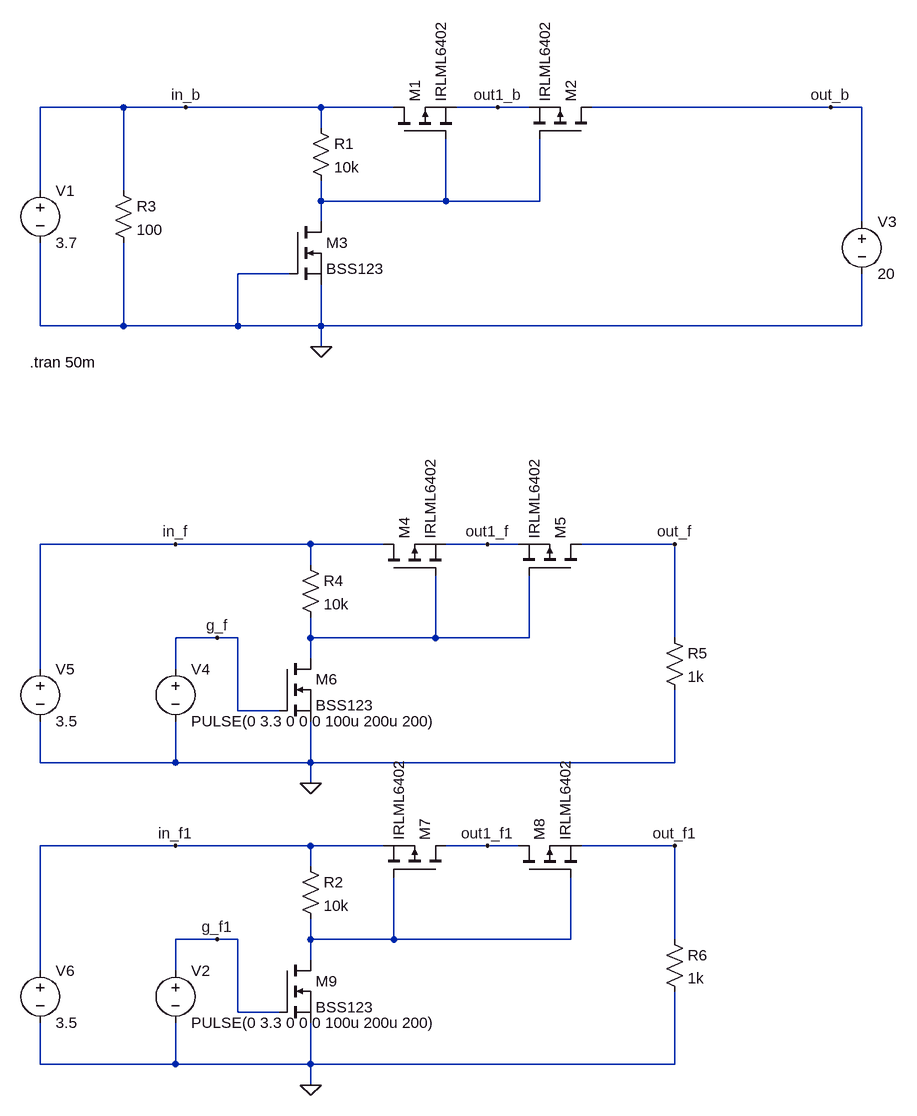
[diagram p0: schematic backDriveProtection.asc]
backDriveProtection.asc, the LTspice schematic file:
Version 4
SHEET 1 880 1620
WIRE -448 96 -576 96
WIRE -352 96 -448 96
WIRE -144 96 -352 96
WIRE -32 96 -144 96
WIRE 128 96 64 96
WIRE 176 96 128 96
WIRE 640 96 272 96
WIRE 688 96 640 96
WIRE -144 128 -144 96
WIRE -576 224 -576 96
WIRE -448 224 -448 96
WIRE -144 240 -144 208
WIRE 48 240 48 144
WIRE 48 240 -144 240
WIRE 192 240 192 144
WIRE 192 240 48 240
WIRE -144 272 -144 240
WIRE 688 272 688 96
WIRE -192 352 -272 352
WIRE -576 432 -576 304
WIRE -448 432 -448 304
WIRE -448 432 -576 432
WIRE -272 432 -272 352
WIRE -272 432 -448 432
WIRE -144 432 -144 368
WIRE -144 432 -272 432
WIRE 688 432 688 352
WIRE 688 432 -144 432
WIRE -144 464 -144 432
WIRE -368 768 -576 768
WIRE -160 768 -368 768
WIRE -48 768 -160 768
WIRE 112 768 48 768
WIRE 160 768 112 768
WIRE 400 768 256 768
WIRE -160 800 -160 768
WIRE -304 912 -368 912
WIRE -272 912 -304 912
WIRE -160 912 -160 880
WIRE 32 912 32 816
WIRE 32 912 -160 912
WIRE 176 912 176 816
WIRE 176 912 32 912
WIRE 400 912 400 768
WIRE -160 944 -160 912
WIRE -576 960 -576 768
WIRE -368 960 -368 912
WIRE -272 1024 -272 912
WIRE -208 1024 -272 1024
WIRE -576 1104 -576 1040
WIRE -368 1104 -368 1040
WIRE -368 1104 -576 1104
WIRE -160 1104 -160 1040
WIRE -160 1104 -368 1104
WIRE 400 1104 400 992
WIRE 400 1104 -160 1104
WIRE -160 1136 -160 1104
WIRE -368 1232 -576 1232
WIRE -160 1232 -368 1232
WIRE -48 1232 -160 1232
WIRE 112 1232 48 1232
WIRE 160 1232 112 1232
WIRE 400 1232 256 1232
WIRE -160 1264 -160 1232
WIRE -304 1376 -368 1376
WIRE -272 1376 -304 1376
WIRE -160 1376 -160 1344
WIRE -32 1376 -32 1280
WIRE -32 1376 -160 1376
WIRE 240 1376 240 1280
WIRE 240 1376 -32 1376
WIRE 400 1376 400 1232
WIRE -160 1408 -160 1376
WIRE -576 1424 -576 1232
WIRE -368 1424 -368 1376
WIRE -272 1488 -272 1376
WIRE -208 1488 -272 1488
WIRE -576 1568 -576 1504
WIRE -368 1568 -368 1504
WIRE -368 1568 -576 1568
WIRE -160 1568 -160 1504
WIRE -160 1568 -368 1568
WIRE 400 1568 400 1456
WIRE 400 1568 -160 1568
WIRE -160 1600 -160 1568
FLAG -144 464 0
FLAG 640 96 out_b
FLAG 128 96 out1_b
FLAG -352 96 in_b
FLAG -160 1136 0
FLAG 400 768 out_f
FLAG 112 768 out1_f
FLAG -304 912 g_f
FLAG -368 768 in_f
FLAG -160 1600 0
FLAG 400 1232 out_f1
FLAG 112 1232 out1_f1
FLAG -304 1376 g_f1
FLAG -368 1232 in_f1
SYMBOL pmos -32 144 R270
SYMATTR InstName M1
SYMATTR Value IRLML6402
SYMBOL pmos 272 144 M270
SYMATTR InstName M2
SYMATTR Value IRLML6402
SYMBOL nmos -192 272 R0
SYMATTR InstName M3
SYMATTR Value BSS123
SYMBOL res -160 112 R0
SYMATTR InstName R1
SYMATTR Value 10k
SYMBOL voltage 688 256 R0
WINDOW 123 0 0 Left 0
WINDOW 39 0 0 Left 0
SYMATTR InstName V3
SYMATTR Value 20
SYMBOL res -464 208 R0
SYMATTR InstName R3
SYMATTR Value 100
SYMBOL pmos -48 816 R270
SYMATTR InstName M4
SYMATTR Value IRLML6402
SYMBOL pmos 256 816 M270
SYMATTR InstName M5
SYMATTR Value IRLML6402
SYMBOL nmos -208 944 R0
SYMATTR InstName M6
SYMATTR Value BSS123
SYMBOL res -176 784 R0
SYMATTR InstName R4
SYMATTR Value 10k
SYMBOL res 384 896 R0
SYMATTR InstName R5
SYMATTR Value 1k
SYMBOL voltage -368 944 R0
WINDOW 123 0 0 Left 0
WINDOW 39 0 0 Left 0
SYMATTR InstName V4
SYMATTR Value PULSE(0 3.3 0 0 0 100u 200u 200)
SYMBOL voltage -576 944 R0
WINDOW 123 0 0 Left 0
WINDOW 39 0 0 Left 0
SYMATTR InstName V5
SYMATTR Value 3.5
SYMBOL voltage -576 208 R0
WINDOW 123 0 0 Left 0
WINDOW 39 0 0 Left 0
SYMATTR InstName V1
SYMATTR Value 3.7
SYMBOL pmos 48 1280 M270
SYMATTR InstName M7
SYMATTR Value IRLML6402
SYMBOL pmos 160 1280 R270
SYMATTR InstName M8
SYMATTR Value IRLML6402
SYMBOL nmos -208 1408 R0
SYMATTR InstName M9
SYMATTR Value BSS123
SYMBOL res -176 1248 R0
SYMATTR InstName R2
SYMATTR Value 10k
SYMBOL res 384 1360 R0
SYMATTR InstName R6
SYMATTR Value 1k
SYMBOL voltage -368 1408 R0
WINDOW 123 0 0 Left 0
WINDOW 39 0 0 Left 0
SYMATTR InstName V2
SYMATTR Value PULSE(0 3.3 0 0 0 100u 200u 200)
SYMBOL voltage -576 1408 R0
WINDOW 123 0 0 Left 0
WINDOW 39 0 0 Left 0
SYMATTR InstName V6
SYMATTR Value 3.5
TEXT -592 488 Left 2 !.tran 50m

The netlist it stands for:
* backDriveProtection.asc
M1 in_b N001 out1_b out1_b IRLML6402
M2 out_b N001 out1_b out1_b IRLML6402
M3 N001 0 0 0 BSS123
R1 in_b N001 10k
V3 out_b 0 20
R3 in_b 0 100
M4 in_f N002 out1_f out1_f IRLML6402
M5 out_f N002 out1_f out1_f IRLML6402
M6 N002 g_f 0 0 BSS123
R4 in_f N002 10k
R5 out_f 0 1k
V4 g_f 0 PULSE(0 3.3 0 0 0 100u 200u 200)
V5 in_f 0 3.5
V1 in_b 0 3.7
M7 out1_f1 N003 in_f1 in_f1 IRLML6402
M8 out1_f1 N003 out_f1 out_f1 IRLML6402
M9 N003 g_f1 0 0 BSS123
R2 in_f1 N003 10k
R6 out_f1 0 1k
V2 g_f1 0 PULSE(0 3.3 0 0 0 100u 200u 200)
V6 in_f1 0 3.5
.model NMOS NMOS
.model PMOS PMOS
.lib standard.mos
.tran 50m
.backanno
.end